# EAGLE schematic MySens-easyRS485-Maple-V01-008 (EAGLE 7.6.0)
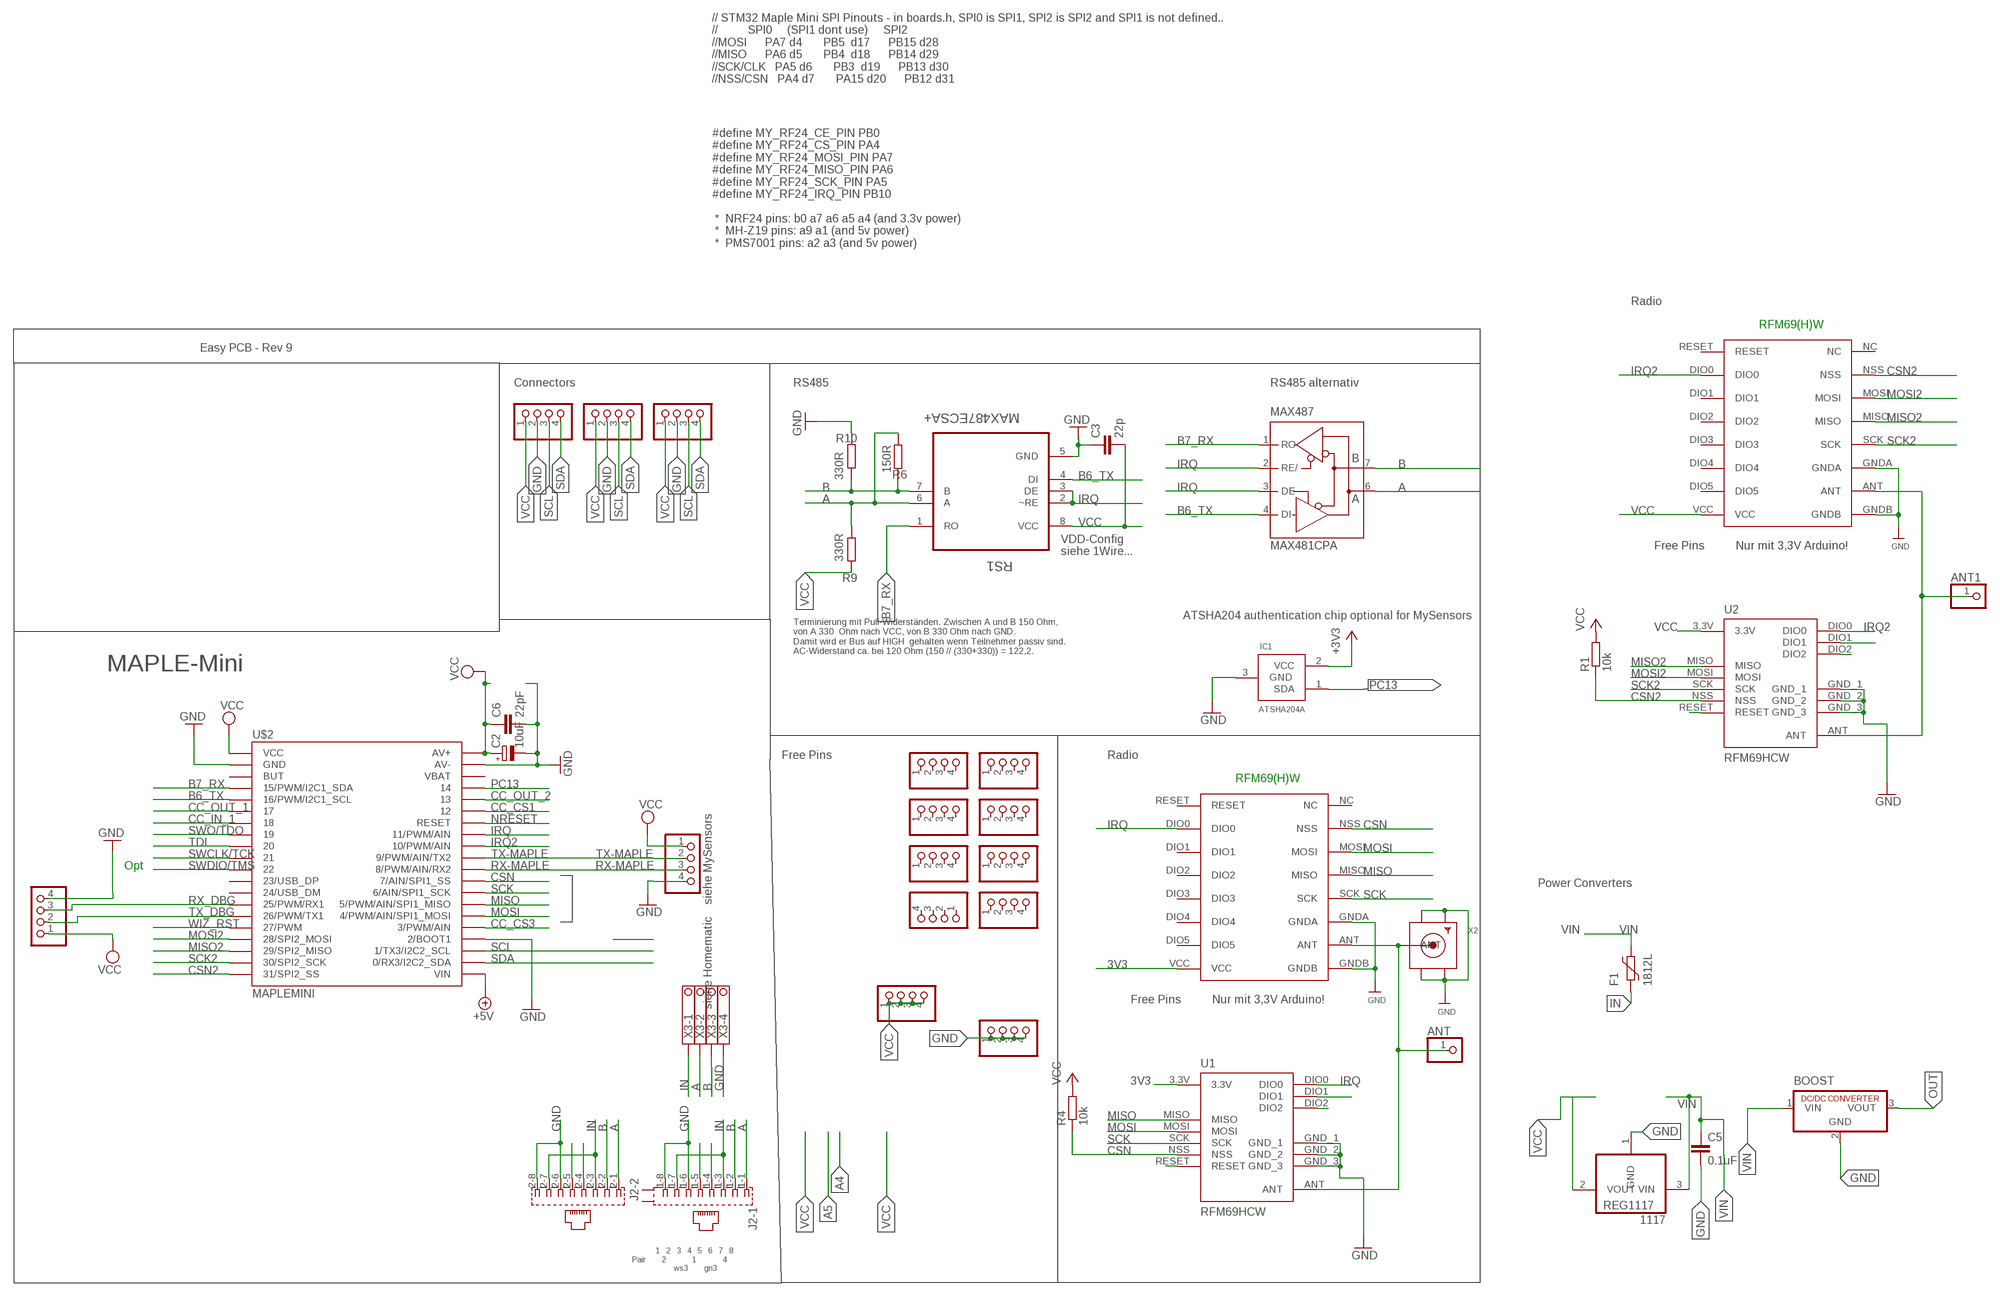
[diagram p0: schematic, sheet 1]

## Parts
1117  REG1117  [SOT223]
ANT  PINHD-1X1  [1X01]
ANT1  PINHD-1X1  [1X01]
BOOST  R-78C1.8-1.0  [SIP3]
C2  10uF  CPOL-EUR/2012-12W  [R/2012-12W]
C3  22p  C-EUC0805  [C0805]
C5  0.1uF  C-EUC1206  [C1206]
C6  22pF  C-EUC0805  [C0805]
DBG  PINHD-1X04_2.54-S  [1X04-S]
F1  1812L  [1812L]
IC1  ATSHA204A  [SOT23]
J2  557570-1  [557570-1]
JP1  PINHD-1X04_2.54-S  [1X04-S]
JP2  PINHD-1X04_2.54-S  [1X04-S]
JP3  PINHD-1X04_2.54-S  [1X04-S]
JP4  PINHD-1X04_2.54-S  [1X04-S]
JP5  PINHD-1X04_2.54-S  [1X04-S]
JP6  PINHD-1X04_2.54-S  [1X04-S]
JP7  PINHD-1X04_2.54-S  [1X04-S]
JP8  PINHD-1X04_2.54-S  [1X04-S]
JP9  PINHD-1X04_2.54-S  [1X04-S]
JP10  PINHD-1X04_2.54-S  [1X04-S]
JP11  PINHD-1X04_2.54-S  [1X04-S]
JP12  PINHD-1X04_2.54-S  [1X04-S]
JP15  PINHD-1X04_2.54-S  [1X04-S]
MAX487  MAX481CPA  [DIL08]
R1  10k  R-EU_M0805  [M0805]
R4  10k  R-EU_M0805  [M0805]
R6  150R  R-EU_R0805  [R0805]
R9  330R  R-EU_R0805  [R0805]
R10  330R  R-EU_R0805  [R0805]
RFM69W  RFM69HW  [RFM]
RFM69W1  RFM69HW  [RFM]
RS1  MAX487ECSA+  [SOIC127P600X175-8N]
U1  RFM69HCW  [RFM69HCW-XXXS2]
U2  RFM69HCW  [RFM69HCW-XXXS2]
U$2  MAPLEMINI  [20-DIP]
UART2  PINHD-1X04_2.54-S  [1X04-S]
X2  SMACONNECTOR_EDGE  [SMA_EDGELAUNCH]
X3  1751264  [1751264]

## Nets
3V3: IC1.2(VCC) RFM69W.VCC U1.3.3V ; supply symbol labelled +3V3
+5V [Power]: U$2.21(VIN)
A: J2.1-1 J2.2-1 MAX487.6(A) R6.1 R9.2 RS1.6(A) X3.2
ANT: ANT.1 RFM69W.ANT U1.ANT X2.P(ANT)
ANT1: ANT1.1 RFM69W1.ANT U2.ANT
B: J2.1-2 J2.2-2 MAX487.7(B) R6.2 R10.1 RS1.7(B) X3.3
B6_TX: MAX487.4(DI) RS1.4(DI) U$2.5(16/PWM/I2C1_SCL)
B7_RX: MAX487.1(RO) RS1.1(RO) U$2.4(15/PWM/I2C1_SDA)
CC_CS1: U$2.35
CC_CS3: U$2.25(3/PWM/AIN)
CC_IN_1: U$2.7
CC_OUT_1: U$2.6
CC_OUT_2: U$2.36
CSN: R4.1 RFM69W.NSS U1.NSS U$2.29(7/AIN/SPI1_SS)
CSN2: R1.1 RFM69W1.NSS U2.NSS U$2.20(31/SPI2_SS)
GND [Power]: 1117.1(GND) BOOST.2(GND) C2.- C3.1 C5.2 C6.2 DBG.4 IC1.3(GND) J2.1-6 J2.1-8 J2.2-6 J2.2-8 JP1.1 JP1.2 JP1.3 JP1.4 JP2.2 JP5.2 JP10.2 R10.2 RFM69W1.GNDA RFM69W1.GNDB RFM69W.GNDA RFM69W.GNDB RS1.5(GND) U1.GND_1 U1.GND_2 U1.GND_3 U2.GND_1 U2.GND_2 U2.GND_3 U$2.2(GND) U$2.24(2/BOOT1) U$2.39(AV-) UART2.4 X2.GND@1(GND4) X2.GND@2(GND3) X2.GND@3(GND2) X2.GND@4(GND1) X3.4
IN [Power]: F1.P$1 J2.1-3 J2.1-7 J2.2-3 J2.2-7 X3.1
IRQ: MAX487.2(RE/) MAX487.3(DE) RFM69W.DIO0 RS1.2(~RE) RS1.3(DE) U1.DIO0 U$2.33(11/PWM/AIN)
IRQ2: RFM69W1.DIO0 U2.DIO0 U$2.32(10/PWM/AIN)
MISO: RFM69W.MISO U1.MISO U$2.27(5/PWM/AIN/SPI1_MISO)
MISO2: RFM69W1.MISO U2.MISO U$2.18(29/SPI2_MISO)
MOSI: RFM69W.MOSI U1.MOSI U$2.26(4/PWM/AIN/SPI1_MOSI)
MOSI2: RFM69W1.MOSI U2.MOSI U$2.17(28/SPI2_MOSI)
N$1: U1.RESET
N$2: J2.1-4
N$3: J2.1-5
N$4: U2.DIO2
N$6: J2.2-4
N$7: J2.2-5
N$8: U2.DIO1
N$9: U2.RESET
N$14: U1.DIO2
N$15: U1.DIO1
NRESET: U$2.34(RESET)
OUT [Power]: BOOST.3(VOUT)
PC13: IC1.1(SDA) U$2.37
RX-MAPLE: U$2.30(8/PWM/AIN/RX2) UART2.3
RX_DBG: DBG.3 U$2.14(25/PWM/RX1)
SCK: RFM69W.SCK U1.SCK U$2.28(6/AIN/SPI1_SCK)
SCK2: RFM69W1.SCK U2.SCK U$2.19(30/SPI2_SCK)
SCL: JP2.3 JP5.3 JP10.3 U$2.23(1/TX3/I2C2_SCL)
SDA: JP2.4 JP5.4 JP10.4 U$2.22(0/RX3/I2C2_SDA)
SWCLK/TCK: U$2.10
SWDIO/TMS: U$2.11
SWO/TDO: U$2.8
TDI: U$2.9
TX-MAPLE: U$2.31(9/PWM/AIN/TX2) UART2.2
TX_DBG: DBG.2 U$2.15(26/PWM/TX1)
VCC [Power]: 1117.2(VOUT) C2.+ C3.2 C6.1 DBG.1 JP2.1 JP3.1 JP3.2 JP3.3 JP3.4 JP5.1 JP10.1 R1.2 R4.2 R9.1 RFM69W1.VCC RS1.8(VCC) U2.3.3V U$2.1(VCC) U$2.40(AV+) UART2.1
VIN [Power]: 1117.3(VIN) BOOST.1(VIN) C5.1 F1.P$2
WIZ_RST: U$2.16(27/PWM)
Unconnected: J2.G1(-1:S2) J2.G3(-1:S1) JP4.1 JP4.2 JP4.3 JP4.4 JP6.1 JP6.2 JP6.3 JP6.4 JP7.1 JP7.2 JP7.3 JP7.4 JP8.1 JP8.2 JP8.3 JP8.4 JP9.1 JP9.2 JP9.3 JP9.4 JP11.1 JP11.2 JP11.3 JP11.4 JP12.1 JP12.2 JP12.3 JP12.4 JP15.1 JP15.2 JP15.3 JP15.4 RFM69W1.DIO1 RFM69W1.DIO2 RFM69W1.DIO3 RFM69W1.DIO4 RFM69W1.DIO5 RFM69W1.NC RFM69W1.RESET RFM69W.DIO1 RFM69W.DIO2 RFM69W.DIO3 RFM69W.DIO4 RFM69W.DIO5 RFM69W.NC RFM69W.RESET U$2.3(BUT) U$2.12(23/USB_DP) U$2.13(24/USB_DM) U$2.38(VBAT)

## Notes on the sheet
- // STM32 Maple Mini SPI Pinouts - in boards.h, SPI0 is SPI1, SPI2 is SPI2 and SPI1 is not defined..
  //          SPI0     (SPI1 dont use)     SPI2
  //MOSI      PA7 d4       PB5  d17      PB15 d28
  //MISO      PA6 d5       PB4  d18      PB14 d29
  //SCK/CLK   PA5 d6       PB3  d19      PB13 d30
  //NSS/CSN   PA4 d7       PA15 d20      PB12 d31
- #define MY_RF24_CE_PIN PB0 
  #define MY_RF24_CS_PIN PA4 
  #define MY_RF24_MOSI_PIN PA7 
  #define MY_RF24_MISO_PIN PA6 
  #define MY_RF24_SCK_PIN PA5 
  #define MY_RF24_IRQ_PIN PB10
  
   *  NRF24 pins: b0 a7 a6 a5 a4 (and 3.3v power)
   *  MH-Z19 pins: a9 a1 (and 5v power)
   *  PMS7001 pins: a2 a3 (and 5v power)
- Radio
- RFM69(H)W
- Easy PCB - Rev 9
- Connectors | RS485 | RS485 alternativ
- Free Pins | Nur mit 3,3V Arduino!
- VDD-Config
  siehe 1Wire...
- ATSHA204 authentication chip optional for MySensors
- Terminierung mit Pull-Widerständen. Zwischen A und B 150 Ohm,
  von A 330  Ohm nach VCC, von B 330 Ohm nach GND. 
  Damit wird er Bus auf HIGH  gehalten wenn Teilnehmer passiv sind.
  AC-Widerstand ca. bei 120 Ohm (150 // (330+330)) = 122,2.
- MAPLE-Mini
- Free Pins | Radio
- RFM69(H)W
- Opt
- Power Converters
- siehe MySensors
- Free Pins | Nur mit 3,3V Arduino!
- siehe Homematic
- 1   2   3   4   5   6   7   8
  Pair        2             1             4
                       ws3        gn3

## Power pins joined to a net without a drawn wire
GND: MAX487.5(GND)
VCC: MAX487.8(VCC)

## Library data of the parts
1117 = burr-brown:REG1117: 800mA and 1A Low Dropout (LDO) Positive Regulator 1.8V, 2.5V, 2.85V, 3.3V, 5V, and Adj; MPN: REG1117; OC_FARNELL: 1097566; OC_NEWARK: 14P6981
ANT ANT1 = pinhead:PINHD-1X1: PIN HEADER
BOOST = dc-dc-converter:R-78C*-1.0: INNOLINE DC/DC-Converter 1.0 AMP SIP3 Single Output Source: Data sheet <http://www.mikrocontroller.net/attachment/150645/157764-da-01-en-DC_DC_WANDLER_R_78C5_0_1_0.pdf>
C2 = rcl:CPOL-EU: POLARIZED CAPACITOR, European symbol
C3 C5 C6 = rcl:C-EU: CAPACITOR, European symbol
DBG JP1-JP12 JP15 UART2 = pinhead-2:PINHD-1X04: PIN HEADER
F1 = ptc-littlefuse:1812L
IC1 = Sensor:ATSHA204A
J2 = con-amp:557570-1: AMP connector
MAX487 = maxim-4:MAX481CPA: RS485 TRANSEIVER
R1 R4 R6 R9 R10 = rcl:R-EU_: RESISTOR, European symbol
RFM69W RFM69W1 = hoperf:RFM69HW
RS1 = Maxim_By_element14_Batch_1:MAX487ECSA+: Low-Power, Slew-Rate-Limited RS-485/RS-422 Transceivers; MPN: MAX487ECSA+; OC_FARNELL: 9724532; OC_NEWARK: 68K4803; PACKAGE: SOIC-8; SUPPLIER: Maxim
U1 U2 = doug:RFM69H
U$2 = maplemini-small:MAPLEMINI
X2 = adafruit:SMACONNECTOR: SMA Connector 90° DIP SMA Connector, 50 Ohm (4UConnector: 07259)
X3 = con-phoenix-350:1751264: MKDS 1/ 4-3,5 Printklemme Nennstrom: 10 A Bemessungsspannung: 160 V Raster: 3,5 mm Polzahl: 4 Montageart: Löten Anschlussart: Schraubanschluss Anschlussrichtung vom Leiter zur Platine: 0° Source: http://eshop.phoenixcontact.com .. 1751264.pdf; MPN: 1751264; OC_FARNELL: unknown; OC_NEWARK: 10R0934

## Net classes
0 default: width 0.305 mm
1 Power: width 0.508 mm